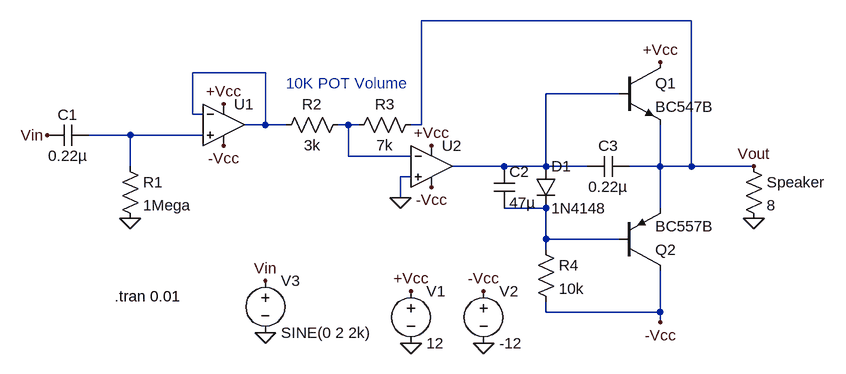
[diagram p0: schematic speaker.asc]
speaker.asc, the LTspice schematic file:
Version 4
SHEET 1 1060 680
WIRE 848 -48 432 -48
WIRE 192 32 80 32
WIRE 736 64 624 64
WIRE 80 96 80 32
WIRE 96 96 80 96
WIRE 192 112 192 32
WIRE 192 112 160 112
WIRE 224 112 192 112
WIRE 320 112 304 112
WIRE 336 112 320 112
WIRE 432 112 432 -48
WIRE 432 112 416 112
WIRE -16 128 -80 128
WIRE 96 128 -16 128
WIRE 320 160 320 112
WIRE 416 160 320 160
WIRE -16 176 -16 128
WIRE 560 176 480 176
WIRE 624 176 624 64
WIRE 624 176 560 176
WIRE 688 176 624 176
WIRE 800 176 800 112
WIRE 800 176 752 176
WIRE 848 176 848 -48
WIRE 848 176 800 176
WIRE 944 176 848 176
WIRE 416 192 400 192
WIRE 400 224 400 192
WIRE 624 240 560 240
WIRE 800 240 800 176
WIRE 624 288 624 240
WIRE 736 288 624 288
WIRE 624 304 624 288
WIRE 624 400 624 384
WIRE 800 400 800 336
WIRE 800 400 624 400
WIRE 800 416 800 400
FLAG 944 256 0
FLAG 128 80 +Vcc
FLAG 448 144 +Vcc
FLAG 800 16 +Vcc
FLAG 128 144 -Vcc
FLAG 448 208 -Vcc
FLAG 800 416 -Vcc
FLAG -16 256 0
FLAG 944 176 Vout
FLAG 528 448 0
FLAG 416 448 0
FLAG 416 368 +Vcc
FLAG 528 368 -Vcc
FLAG -144 128 Vin
FLAG 400 224 0
FLAG 192 432 0
FLAG 192 352 Vin
SYMBOL cap -80 112 R90
WINDOW 0 0 32 VBottom 2
WINDOW 3 32 32 VTop 2
SYMATTR InstName C1
SYMATTR Value 0.22µ
SYMBOL res -32 160 R0
SYMATTR InstName R1
SYMATTR Value 1Mega
SYMBOL OpAmps\\UniversalOpAmp2 128 112 R0
SYMATTR InstName U1
SYMBOL res 320 96 R90
WINDOW 0 0 56 VBottom 2
WINDOW 3 32 56 VTop 2
SYMATTR InstName R2
SYMATTR Value 3k
SYMBOL OpAmps\\UniversalOpAmp2 448 176 R0
SYMATTR InstName U2
SYMBOL res 432 96 R90
WINDOW 0 0 56 VBottom 2
WINDOW 3 32 56 VTop 2
SYMATTR InstName R3
SYMATTR Value 7k
SYMBOL cap 544 176 R0
SYMATTR InstName C2
SYMATTR Value 47µ
SYMBOL diode 608 176 R0
SYMATTR InstName D1
SYMATTR Value 1N4148
SYMBOL cap 752 160 R90
WINDOW 0 0 32 VBottom 2
WINDOW 3 32 32 VTop 2
SYMATTR InstName C3
SYMATTR Value 0.22µ
SYMBOL npn 736 16 R0
SYMATTR InstName Q1
SYMATTR Value BC547B
SYMBOL pnp 736 336 M180
SYMATTR InstName Q2
SYMATTR Value BC557B
SYMBOL res 608 288 R0
SYMATTR InstName R4
SYMATTR Value 10k
SYMBOL res 928 160 R0
SYMATTR InstName Speaker
SYMATTR Value 8
SYMBOL voltage 416 352 R0
WINDOW 123 0 0 Left 0
WINDOW 39 0 0 Left 0
SYMATTR InstName V1
SYMATTR Value 12
SYMBOL voltage 528 352 R0
WINDOW 123 0 0 Left 0
WINDOW 39 0 0 Left 0
SYMATTR InstName V2
SYMATTR Value -12
SYMBOL voltage 192 336 R0
WINDOW 123 0 0 Left 0
WINDOW 39 0 0 Left 0
SYMATTR InstName V3
SYMATTR Value SINE(0 2 2k)
TEXT -40 376 Left 2 !.tran 0.01
TEXT 224 48 Left 2 ;10K POT Volume

The netlist it stands for:
* speaker.asc
C1 N004 Vin 0.22µ
R1 N004 0 1Mega
XU1 N004 N001 +Vcc -Vcc N001 level2 Avol=1Meg GBW=10Meg Slew=10Meg Ilimit=25m Rail=0 Vos=0 En=0 Enk=0 In=0 Ink=0 Rin=500Meg  ; pins In+ In- V+ V- OUT
R2 N003 N001 3k
XU2 0 N003 +Vcc -Vcc N002 level2 Avol=1Meg GBW=10Meg Slew=10Meg Ilimit=25m Rail=0 Vos=0 En=0 Enk=0 In=0 Ink=0 Rin=500Meg  ; pins In+ In- V+ V- OUT
R3 Vout N003 7k
C2 N002 N005 47µ
D1 N002 N005 1N4148
C3 Vout N002 0.22µ
Q1 +Vcc N002 Vout 0 BC547B
Q2 -Vcc N005 Vout 0 BC557B
R4 N005 -Vcc 10k
R§Speaker Vout 0 8
V1 +Vcc 0 12
V2 -Vcc 0 -12
V3 Vin 0 SINE(0 2 2k)
.model D D
.lib standard.dio
.model NPN NPN
.model PNP PNP
.lib standard.bjt
.tran 0.01
* 10K POT Volume
.lib UniversalOpAmp2.lib
.backanno
.end